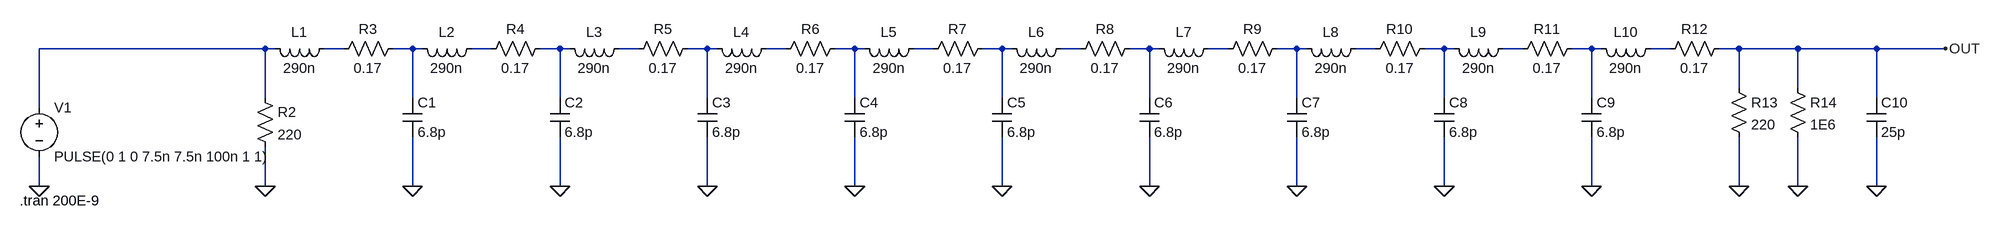
[diagram p0: schematic 10 cell_improved.asc]
10 cell_improved.asc, the LTspice schematic file:
Version 4
SHEET 1 1476 680
WIRE -1328 -32 -1696 -32
WIRE -1312 -32 -1328 -32
WIRE -1200 -32 -1232 -32
WIRE -1088 -32 -1120 -32
WIRE -1072 -32 -1088 -32
WIRE -960 -32 -992 -32
WIRE -848 -32 -880 -32
WIRE -832 -32 -848 -32
WIRE -720 -32 -752 -32
WIRE -608 -32 -640 -32
WIRE -592 -32 -608 -32
WIRE -480 -32 -512 -32
WIRE -368 -32 -400 -32
WIRE -352 -32 -368 -32
WIRE -240 -32 -272 -32
WIRE -128 -32 -160 -32
WIRE -112 -32 -128 -32
WIRE 0 -32 -32 -32
WIRE 112 -32 80 -32
WIRE 128 -32 112 -32
WIRE 240 -32 208 -32
WIRE 352 -32 320 -32
WIRE 368 -32 352 -32
WIRE 480 -32 448 -32
WIRE 592 -32 560 -32
WIRE 608 -32 592 -32
WIRE 720 -32 688 -32
WIRE 832 -32 800 -32
WIRE 848 -32 832 -32
WIRE 960 -32 928 -32
WIRE 1072 -32 1040 -32
WIRE 1168 -32 1072 -32
WIRE 1296 -32 1168 -32
WIRE 1408 -32 1296 -32
WIRE 1072 32 1072 -32
WIRE 1168 32 1168 -32
WIRE -1328 48 -1328 -32
WIRE -1088 48 -1088 -32
WIRE -848 48 -848 -32
WIRE -608 48 -608 -32
WIRE -368 48 -368 -32
WIRE -128 48 -128 -32
WIRE 112 48 112 -32
WIRE 352 48 352 -32
WIRE 592 48 592 -32
WIRE 832 48 832 -32
WIRE 1296 48 1296 -32
WIRE -1696 64 -1696 -32
WIRE -1696 192 -1696 144
WIRE -1328 192 -1328 128
WIRE -1088 192 -1088 112
WIRE -848 192 -848 112
WIRE -608 192 -608 112
WIRE -368 192 -368 112
WIRE -128 192 -128 112
WIRE 112 192 112 112
WIRE 352 192 352 112
WIRE 592 192 592 112
WIRE 832 192 832 112
WIRE 1072 192 1072 112
WIRE 1168 192 1168 112
WIRE 1296 192 1296 112
FLAG -1696 192 0
FLAG -1328 192 0
FLAG -1088 192 0
FLAG -848 192 0
FLAG -608 192 0
FLAG -368 192 0
FLAG -128 192 0
FLAG 112 192 0
FLAG 352 192 0
FLAG 592 192 0
FLAG 832 192 0
FLAG 1072 192 0
FLAG 1168 192 0
FLAG 1296 192 0
FLAG 1408 -32 OUT
SYMBOL voltage -1696 48 R0
WINDOW 123 0 0 Left 0
WINDOW 39 0 0 Left 0
SYMATTR InstName V1
SYMATTR Value PULSE(0 1 0 7.5n 7.5n 100n 1 1)
SYMBOL res -1344 32 R0
SYMATTR InstName R2
SYMATTR Value 220
SYMBOL ind -1216 -48 R90
WINDOW 0 5 56 VBottom 2
WINDOW 3 32 56 VTop 2
SYMATTR InstName L1
SYMATTR Value 290n
SYMBOL res -1104 -48 R90
WINDOW 0 0 56 VBottom 2
WINDOW 3 32 56 VTop 2
SYMATTR InstName R3
SYMATTR Value 0.17
SYMBOL cap -1104 48 R0
SYMATTR InstName C1
SYMATTR Value 6.8p
SYMBOL ind -976 -48 R90
WINDOW 0 5 56 VBottom 2
WINDOW 3 32 56 VTop 2
SYMATTR InstName L2
SYMATTR Value 290n
SYMBOL res -864 -48 R90
WINDOW 0 0 56 VBottom 2
WINDOW 3 32 56 VTop 2
SYMATTR InstName R4
SYMATTR Value 0.17
SYMBOL cap -864 48 R0
SYMATTR InstName C2
SYMATTR Value 6.8p
SYMBOL ind -736 -48 R90
WINDOW 0 5 56 VBottom 2
WINDOW 3 32 56 VTop 2
SYMATTR InstName L3
SYMATTR Value 290n
SYMBOL res -624 -48 R90
WINDOW 0 0 56 VBottom 2
WINDOW 3 32 56 VTop 2
SYMATTR InstName R5
SYMATTR Value 0.17
SYMBOL cap -624 48 R0
SYMATTR InstName C3
SYMATTR Value 6.8p
SYMBOL ind -496 -48 R90
WINDOW 0 5 56 VBottom 2
WINDOW 3 32 56 VTop 2
SYMATTR InstName L4
SYMATTR Value 290n
SYMBOL res -384 -48 R90
WINDOW 0 0 56 VBottom 2
WINDOW 3 32 56 VTop 2
SYMATTR InstName R6
SYMATTR Value 0.17
SYMBOL cap -384 48 R0
SYMATTR InstName C4
SYMATTR Value 6.8p
SYMBOL ind -256 -48 R90
WINDOW 0 5 56 VBottom 2
WINDOW 3 32 56 VTop 2
SYMATTR InstName L5
SYMATTR Value 290n
SYMBOL res -144 -48 R90
WINDOW 0 0 56 VBottom 2
WINDOW 3 32 56 VTop 2
SYMATTR InstName R7
SYMATTR Value 0.17
SYMBOL cap -144 48 R0
SYMATTR InstName C5
SYMATTR Value 6.8p
SYMBOL ind -16 -48 R90
WINDOW 0 5 56 VBottom 2
WINDOW 3 32 56 VTop 2
SYMATTR InstName L6
SYMATTR Value 290n
SYMBOL res 96 -48 R90
WINDOW 0 0 56 VBottom 2
WINDOW 3 32 56 VTop 2
SYMATTR InstName R8
SYMATTR Value 0.17
SYMBOL cap 96 48 R0
SYMATTR InstName C6
SYMATTR Value 6.8p
SYMBOL ind 224 -48 R90
WINDOW 0 5 56 VBottom 2
WINDOW 3 32 56 VTop 2
SYMATTR InstName L7
SYMATTR Value 290n
SYMBOL res 336 -48 R90
WINDOW 0 0 56 VBottom 2
WINDOW 3 32 56 VTop 2
SYMATTR InstName R9
SYMATTR Value 0.17
SYMBOL cap 336 48 R0
SYMATTR InstName C7
SYMATTR Value 6.8p
SYMBOL ind 464 -48 R90
WINDOW 0 5 56 VBottom 2
WINDOW 3 32 56 VTop 2
SYMATTR InstName L8
SYMATTR Value 290n
SYMBOL res 576 -48 R90
WINDOW 0 0 56 VBottom 2
WINDOW 3 32 56 VTop 2
SYMATTR InstName R10
SYMATTR Value 0.17
SYMBOL cap 576 48 R0
SYMATTR InstName C8
SYMATTR Value 6.8p
SYMBOL ind 704 -48 R90
WINDOW 0 5 56 VBottom 2
WINDOW 3 32 56 VTop 2
SYMATTR InstName L9
SYMATTR Value 290n
SYMBOL res 816 -48 R90
WINDOW 0 0 56 VBottom 2
WINDOW 3 32 56 VTop 2
SYMATTR InstName R11
SYMATTR Value 0.17
SYMBOL cap 816 48 R0
SYMATTR InstName C9
SYMATTR Value 6.8p
SYMBOL ind 944 -48 R90
WINDOW 0 5 56 VBottom 2
WINDOW 3 32 56 VTop 2
SYMATTR InstName L10
SYMATTR Value 290n
SYMBOL res 1056 -48 R90
WINDOW 0 0 56 VBottom 2
WINDOW 3 32 56 VTop 2
SYMATTR InstName R12
SYMATTR Value 0.17
SYMBOL res 1056 16 R0
SYMATTR InstName R13
SYMATTR Value 220
SYMBOL res 1152 16 R0
SYMATTR InstName R14
SYMATTR Value 1E6
SYMBOL cap 1280 48 R0
SYMATTR InstName C10
SYMATTR Value 25p
TEXT -1728 216 Left 2 !.tran 200E-9

The netlist it stands for:
* 10 cell_improved.asc
V1 N001 0 PULSE(0 1 0 7.5n 7.5n 100n 1 1)
R2 N001 0 220
L1 N002 N001 290n
R3 N003 N002 0.17
C1 N003 0 6.8p
L2 N004 N003 290n
R4 N005 N004 0.17
C2 N005 0 6.8p
L3 N006 N005 290n
R5 N007 N006 0.17
C3 N007 0 6.8p
L4 N008 N007 290n
R6 N009 N008 0.17
C4 N009 0 6.8p
L5 N010 N009 290n
R7 N011 N010 0.17
C5 N011 0 6.8p
L6 N012 N011 290n
R8 N013 N012 0.17
C6 N013 0 6.8p
L7 N014 N013 290n
R9 N015 N014 0.17
C7 N015 0 6.8p
L8 N016 N015 290n
R10 N017 N016 0.17
C8 N017 0 6.8p
L9 N018 N017 290n
R11 N019 N018 0.17
C9 N019 0 6.8p
L10 N020 N019 290n
R12 OUT N020 0.17
R13 OUT 0 220
R14 OUT 0 1E6
C10 OUT 0 25p
.tran 200E-9
.backanno
.end